# EAGLE design H851X (EAGLE 6.6.0)
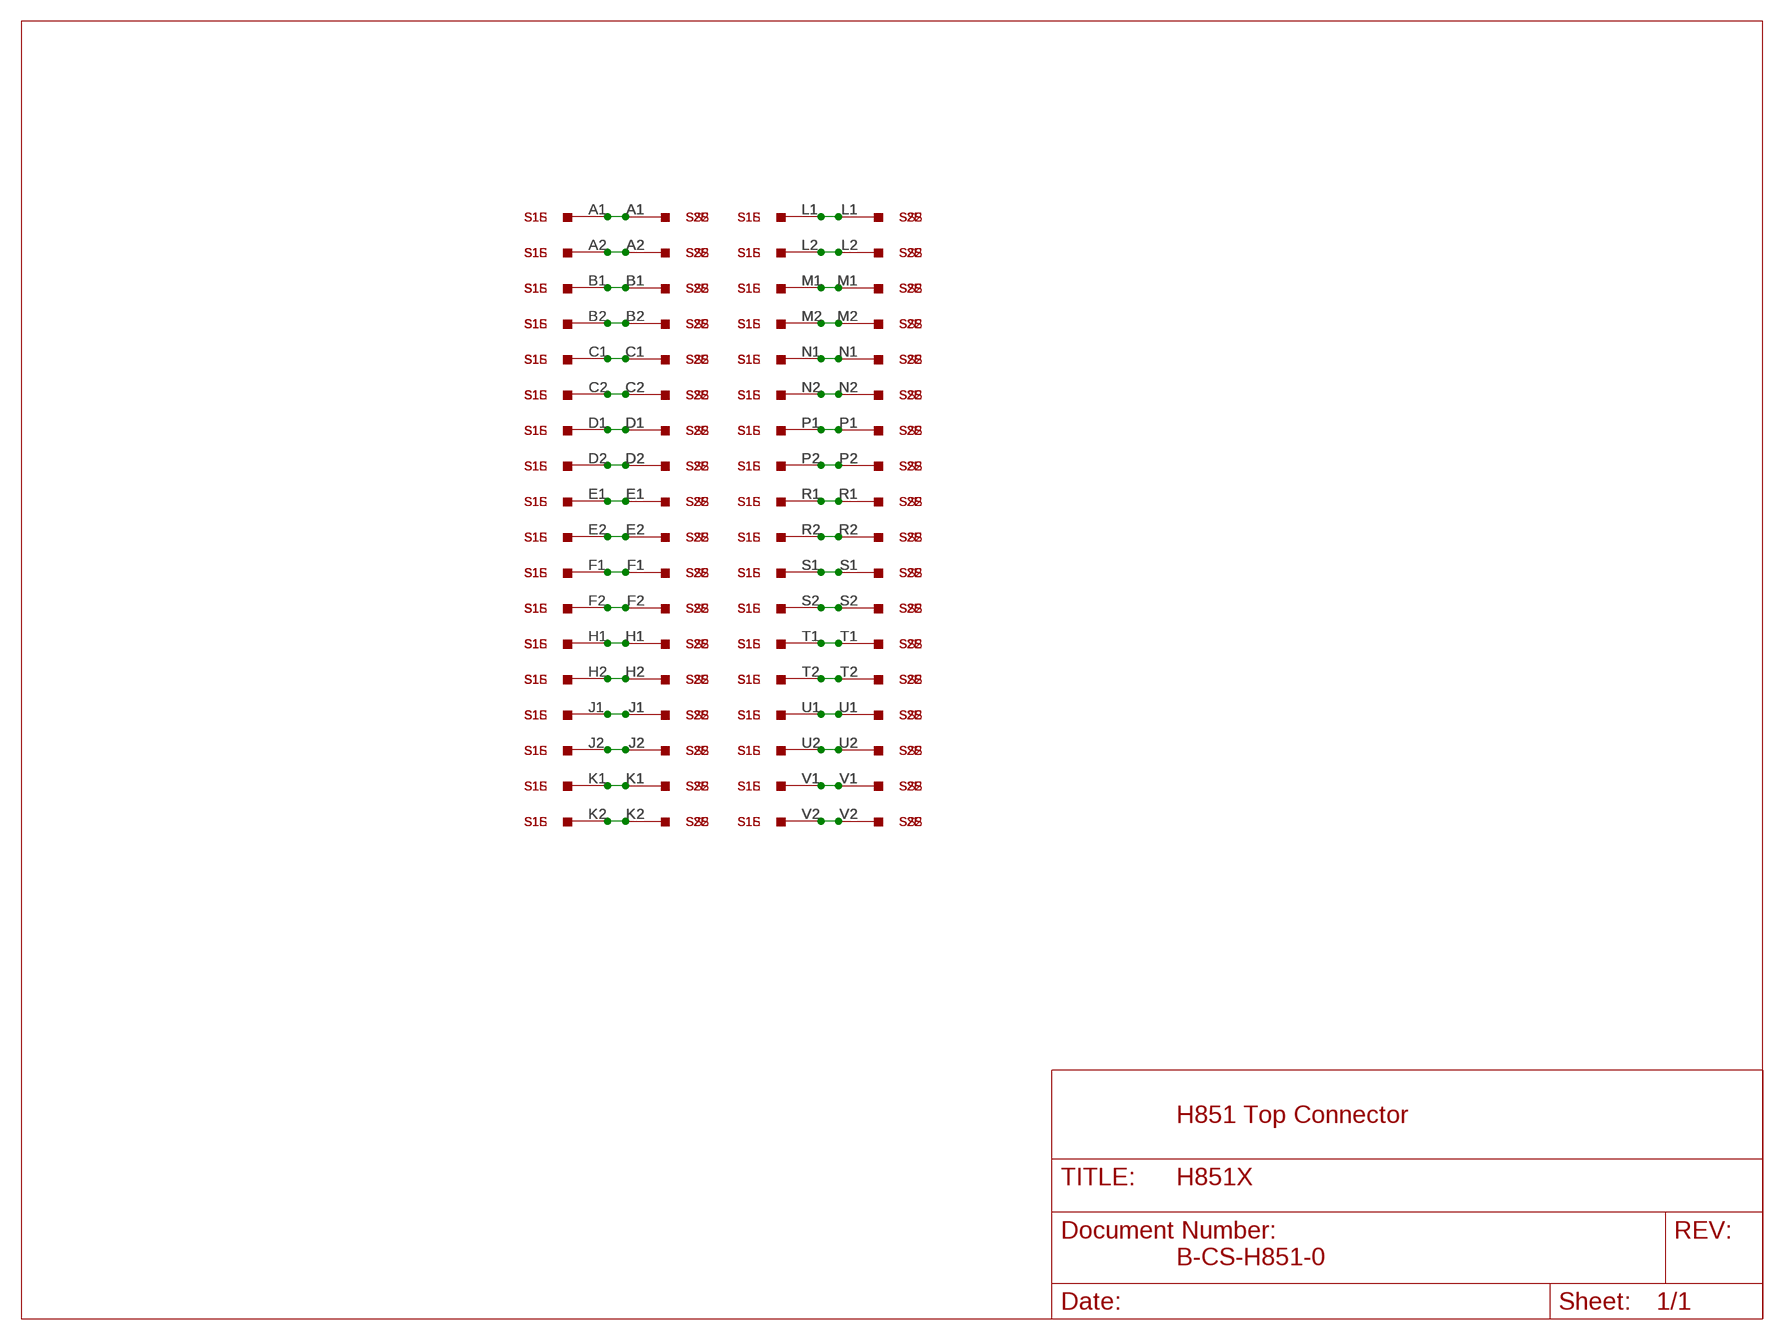
[diagram p0: schematic, sheet 1]

## Parts
S1  M916  [H807]
S1E  M916EDAC  [EDAC346-36]
S1S  M916ECS  [ECS2418]
S2  M916  [H807]
S2E  M916EDAC  [EDAC346-36]
S2S  M916ECS  [ECS2418]

## Nets
N$1: S1.L1 S1E.L1 S1S.L1 S2.L1 S2E.L1 S2S.L1
N$2: S1.L2 S1E.L2 S1S.L2 S2.L2 S2E.L2 S2S.L2
N$3: S1.M1 S1E.M1 S1S.M1 S2.M1 S2E.M1 S2S.M1
N$4: S1.M2 S1E.M2 S1S.M2 S2.M2 S2E.M2 S2S.M2
N$5: S1.N1 S1E.N1 S1S.N1 S2.N1 S2E.N1 S2S.N1
N$6: S1.N2 S1E.N2 S1S.N2 S2.N2 S2E.N2 S2S.N2
N$7: S1.P1 S1E.P1 S1S.P1 S2.P1 S2E.P1 S2S.P1
N$8: S1.P2 S1E.P2 S1S.P2 S2.P2 S2E.P2 S2S.P2
N$9: S1.R1 S1E.R1 S1S.R1 S2.R1 S2E.R1 S2S.R1
N$10: S1.R2 S1E.R2 S1S.R2 S2.R2 S2E.R2 S2S.R2
N$11: S1.S1 S1E.S1 S1S.S1 S2.S1 S2E.S1 S2S.S1
N$12: S1.S2 S1E.S2 S1S.S2 S2.S2 S2E.S2 S2S.S2
N$13: S1.T1 S1E.T1 S1S.T1 S2.T1 S2E.T1 S2S.T1
N$14: S1.T2 S1E.T2 S1S.T2 S2.T2 S2E.T2 S2S.T2
N$15: S1.U1 S1E.U1 S1S.U1 S2.U1 S2E.U1 S2S.U1
N$16: S1.U2 S1E.U2 S1S.U2 S2.U2 S2E.U2 S2S.U2
N$17: S1.V1 S1E.V1 S1S.V1 S2.V1 S2E.V1 S2S.V1
N$18: S1.V2 S1E.V2 S1S.V2 S2.V2 S2E.V2 S2S.V2
N$19: S1.A1 S1E.A1 S1S.A1 S2.A1 S2E.A1 S2S.A1
N$20: S1.A2 S1E.A2 S1S.A2 S2.A2 S2E.A2 S2S.A2
N$21: S1.B1 S1E.B1 S1S.B1 S2.B1 S2E.B1 S2S.B1
N$22: S1.B2 S1E.B2 S1S.B2 S2.B2 S2E.B2 S2S.B2
N$23: S1.C1 S1E.C1 S1S.C1 S2.C1 S2E.C1 S2S.C1
N$24: S1.C2 S1E.C2 S1S.C2 S2.C2 S2E.C2 S2S.C2
N$25: S1.D1 S1E.D1 S1S.D1 S2.D1 S2E.D1 S2S.D1
N$26: S1.D2 S1E.D2 S1S.D2 S2.D2 S2E.D2 S2S.D2
N$27: S1.E1 S1E.E1 S1S.E1 S2.E1 S2E.E1 S2S.E1
N$28: S1.E2 S1E.E2 S1S.E2 S2.E2 S2E.E2 S2S.E2
N$29: S1.F1 S1E.F1 S1S.F1 S2.F1 S2E.F1 S2S.F1
N$30: S1.F2 S1E.F2 S1S.F2 S2.F2 S2E.F2 S2S.F2
N$31: S1.H1 S1E.H1 S1S.H1 S2.H1 S2E.H1 S2S.H1
N$32: S1.H2 S1E.H2 S1S.H2 S2.H2 S2E.H2 S2S.H2
N$33: S1.J1 S1E.J1 S1S.J1 S2.J1 S2E.J1 S2S.J1
N$34: S1.J2 S1E.J2 S1S.J2 S2.J2 S2E.J2 S2S.J2
N$35: S1.K1 S1E.K1 S1S.K1 S2.K1 S2E.K1 S2S.K1
N$36: S1.K2 S1E.K2 S1S.K2 S2.K2 S2E.K2 S2S.K2

## Notes on the sheet
- H851 Top Connector
- B-CS-H851-0

## Library data of the parts
S1 S1E S1S S2 S2E S2S = dec-m:M916: Simple 36 pin connector/wire cable

## Board
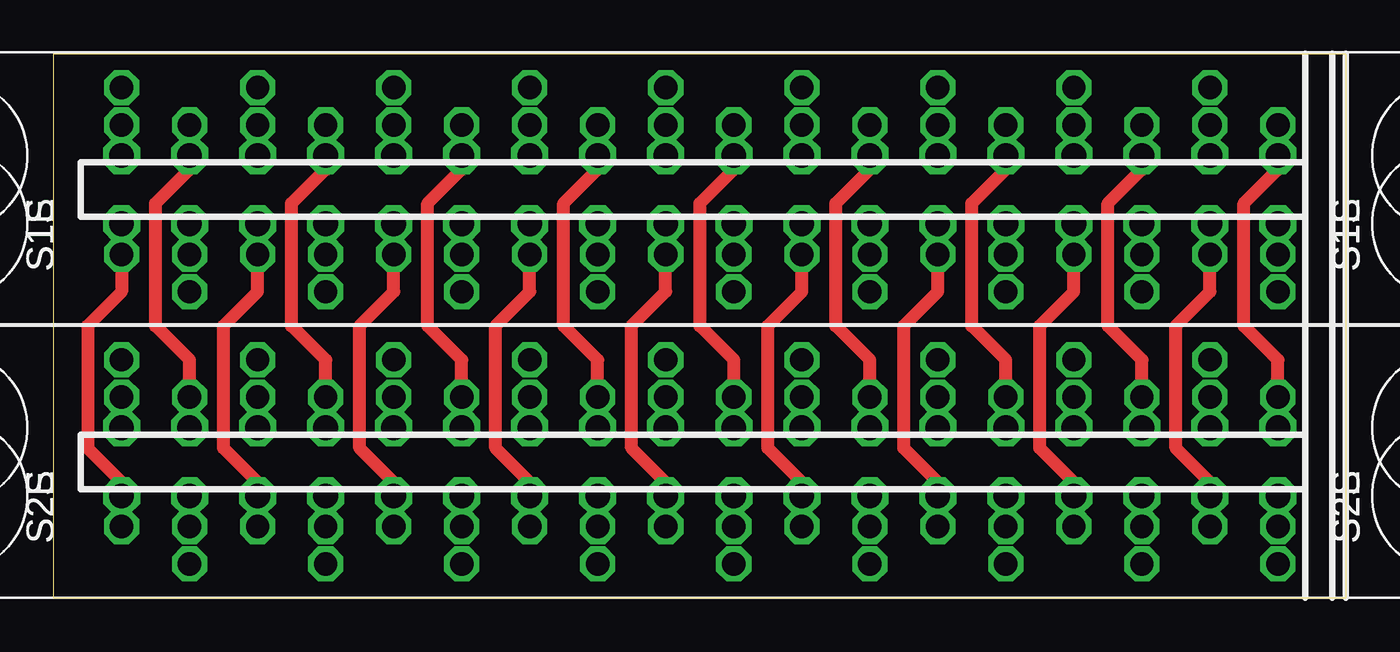
[diagram p1: board, top side]
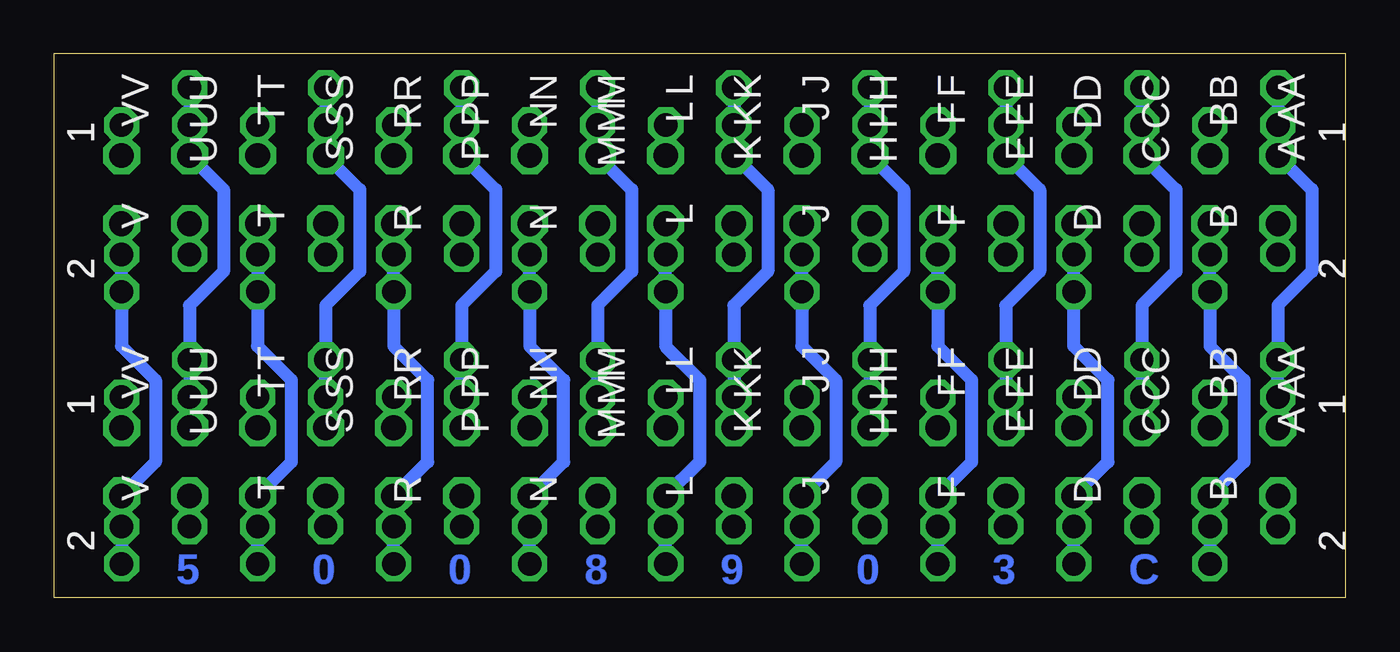
[diagram p2: board, bottom side, seen from below]

Size 60.33 x 25.4 mm. Coordinates in mm from the lower left corner, seen from the top.
Outline: 0,0 0,25.4 60.33,25.4 60.33,0 0,0
Copper layers (1+16): Top 0.035mm / dielectric 1.5mm / Bottom 0.035mm
Design rules "16mils": minimum track width 16mil, minimum drill 32mil, track to track 15mil, track to pad 10mil, pad to pad 10mil, via to via 10mil, smd to smd 10mil, copper to edge 13mil, drill to drill 10mil, minimum pad ring 10mil, minimum via ring 8mil, stop-mask expansion 0mil, vias tented up to drill 0mil, thermal gap 10mil

### Footprints (pad centres in the part's own frame; a part is rotated, then mirrored left to right if it is on the bottom)
H807 = drill 1.092 octagon: A1 4.763,28.575; A2 -1.587,28.575; B1 1.587,25.4; B2 -4.763,25.4; C1 4.763,22.225; C2 -1.587,22.225; D1 1.587,19.05; D2 -4.763,19.05; E1 4.763,15.875; E2 -1.587,15.875; F1 1.587,12.7; F2 -4.763,12.7; H1 4.763,9.525; H2 -1.587,9.525; J1 1.587,6.35; J2 -4.763,6.35; K1 4.763,3.175; K2 -1.587,3.175; L1 1.587,0; L2 -4.763,0; M1 4.763,-3.175; M2 -1.587,-3.175; N1 1.587,-6.35; N2 -4.763,-6.35; P1 4.763,-9.525; P2 -1.587,-9.525; R1 1.587,-12.7; R2 -4.763,-12.7; S1 4.763,-15.875; S2 -1.587,-15.875; T1 1.587,-19.05; T2 -4.763,-19.05; U1 4.763,-22.225; U2 -1.587,-22.225; V1 1.587,-25.4; V2 -4.763,-25.4
EDAC346-36 = drill 1.092 octagon: A1 3.016,28.575; A2 -3.016,28.575; B1 3.016,25.4; B2 -3.016,25.4; C1 3.016,22.225; C2 -3.016,22.225; D1 3.016,19.05; D2 -3.016,19.05; E1 3.016,15.875; E2 -3.016,15.875; F1 3.016,12.7; F2 -3.016,12.7; H1 3.016,9.525; H2 -3.016,9.525; J1 3.016,6.35; J2 -3.016,6.35; K1 3.016,3.175; K2 -3.016,3.175; L1 3.016,0; L2 -3.016,0; M1 3.016,-3.175; M2 -3.016,-3.175; N1 3.016,-6.35; N2 -3.016,-6.35; P1 3.016,-9.525; P2 -3.016,-9.525; R1 3.016,-12.7; R2 -3.016,-12.7; S1 3.016,-15.875; S2 -3.016,-15.875; T1 3.016,-19.05; T2 -3.016,-19.05; U1 3.016,-22.225; U2 -3.016,-22.225; V1 3.016,-25.4; V2 -3.016,-25.4
ECS2418 = drill 1.151 octagon: A1 1.587,28.575; A2 -1.587,28.575; B1 1.587,25.4; B2 -1.587,25.4; C1 1.587,22.225; C2 -1.587,22.225; D1 1.587,19.05; D2 -1.587,19.05; E1 1.587,15.875; E2 -1.587,15.875; F1 1.587,12.7; F2 -1.587,12.7; H1 1.587,9.525; H2 -1.587,9.525; J1 1.587,6.35; J2 -1.587,6.35; K1 1.587,3.175; K2 -1.587,3.175; L1 1.587,0; L2 -1.587,0; M1 1.587,-3.175; M2 -1.587,-3.175; N1 1.587,-6.35; N2 -1.587,-6.35; P1 1.587,-9.525; P2 -1.587,-9.525; R1 1.587,-12.7; R2 -1.587,-12.7; S1 1.587,-15.875; S2 -1.587,-15.875; T1 1.587,-19.05; T2 -1.587,-19.05; U1 1.587,-22.225; U2 -1.587,-22.225; V1 1.587,-25.4; V2 -1.587,-25.4

### Placement (x,y rotation side)
S1  31.75,19.05 90 top
S1E  31.75,19.05 90 top
S1S  31.75,19.05 90 top
S2  31.75,6.35 90 top
S2E  31.75,6.35 90 top
S2S  31.75,6.35 90 top

### Tracks (layer width: path | path; a pad name or v marks a point on that pad's centre or on a via)
N$1
  Top 0.61: S2S.L1 S2E.L1 31.75,11.11 30.16,12.7 30.16,18.41 31.75,20 S1S.L1 S1E.L1
N$2
  Bottom 0.61: S2.L2 S2E.L2 S2S.L2 30.16,6.35 30.16,10.16 31.75,11.75 S1.L2 S1E.L2 S1S.L2
N$3
  Bottom 0.61: S1.M1 S1E.M1 S1S.M1 33.34,19.05 33.34,15.24 34.92,13.65 S2.M1 S2E.M1 S2S.M1
N$4
  Top 0.61: S2E.M2 S2S.M2 34.92,5.4 33.34,6.99 33.34,12.7 34.92,14.29 S1E.M2 S1S.M2
N$5
  Top 0.61: S2S.N1 S2E.N1 38.1,11.11 36.51,12.7 36.51,18.41 38.1,20 S1S.N1 S1E.N1
N$6
  Bottom 0.61: S2.N2 S2E.N2 S2S.N2 36.51,6.35 36.51,10.16 38.1,11.75 S1.N2 S1E.N2 S1S.N2
N$7
  Bottom 0.61: S1.P1 S1E.P1 S1S.P1 39.69,19.05 39.69,15.24 41.27,13.65 S2.P1 S2E.P1 S2S.P1
N$8
  Top 0.61: S2E.P2 S2S.P2 41.27,5.4 39.69,6.99 39.69,12.7 41.27,14.29 S1E.P2 S1S.P2
N$9
  Top 0.61: S2S.R1 S2E.R1 44.45,11.11 42.86,12.7 42.86,18.41 44.45,20 S1S.R1 S1E.R1
N$10
  Bottom 0.61: S2.R2 S2E.R2 S2S.R2 42.86,6.35 42.86,10.16 44.45,11.75 S1.R2 S1E.R2 S1S.R2
N$11
  Bottom 0.61: S1.S1 S1E.S1 S1S.S1 46.04,19.05 46.04,15.24 47.62,13.65 S2.S1 S2E.S1 S2S.S1
N$12
  Top 0.61: S2E.S2 S2S.S2 47.62,5.4 46.04,6.99 46.04,12.7 47.62,14.29 S1E.S2 S1S.S2
N$13
  Top 0.61: S2S.T1 S2E.T1 50.8,11.11 49.21,12.7 49.21,18.41 50.8,20 S1S.T1 S1E.T1
N$14
  Bottom 0.61: S2.T2 S2E.T2 S2S.T2 49.21,6.35 49.21,10.16 50.8,11.75 S1.T2 S1E.T2 S1S.T2
N$15
  Bottom 0.61: S1.U1 S1E.U1 S1S.U1 52.39,19.05 52.39,15.24 53.98,13.65 S2.U1 S2E.U1 S2S.U1
N$16
  Top 0.61: S2E.U2 S2S.U2 53.98,5.4 52.39,6.99 52.39,12.7 53.98,14.29 S1E.U2 S1S.U2
N$17
  Top 0.61: S2S.V1 S2E.V1 57.15,11.11 55.56,12.7 55.56,18.41 57.15,20 S1S.V1 S1E.V1
N$18
  Bottom 0.61: S2.V2 S2E.V2 S2S.V2 55.56,6.35 55.56,10.16 57.15,11.75 S1.V2 S1E.V2 S1S.V2
N$19
  Bottom 0.61: S1.A1 S1E.A1 S1S.A1 1.59,19.05 1.59,15.24 3.17,13.65 S2.A1 S2E.A1 S2S.A1
N$20
  Top 0.61: S2E.A2 S2S.A2 3.17,5.4 1.59,6.99 1.59,12.7 3.17,14.29 S1E.A2 S1S.A2
N$21
  Top 0.61: S2S.B1 S2E.B1 6.35,11.11 4.76,12.7 4.76,18.41 6.35,20 S1S.B1 S1E.B1
N$22
  Bottom 0.61: S2.B2 S2E.B2 S2S.B2 4.76,6.35 4.76,10.16 6.35,11.75 S1.B2 S1E.B2 S1S.B2
N$23
  Bottom 0.61: S1.C1 S1E.C1 S1S.C1 7.94,19.05 7.94,15.24 9.53,13.65 S2.C1 S2E.C1 S2S.C1
N$24
  Top 0.61: S2E.C2 S2S.C2 9.53,5.4 7.94,6.99 7.94,12.7 9.53,14.29 S1E.C2 S1S.C2
N$25
  Top 0.61: S2S.D1 S2E.D1 12.7,11.11 11.11,12.7 11.11,18.41 12.7,20 S1S.D1 S1E.D1
N$26
  Bottom 0.61: S2.D2 S2E.D2 S2S.D2 11.11,6.35 11.11,10.16 12.7,11.75 S1.D2 S1E.D2 S1S.D2
N$27
  Bottom 0.61: S1.E1 S1E.E1 S1S.E1 14.29,19.05 14.29,15.24 15.88,13.65 S2.E1 S2E.E1 S2S.E1
N$28
  Top 0.61: S2E.E2 S2S.E2 15.88,5.4 14.29,6.99 14.29,12.7 15.88,14.29 S1E.E2 S1S.E2
N$29
  Top 0.61: S2S.F1 S2E.F1 19.05,11.11 17.46,12.7 17.46,18.41 19.05,20 S1S.F1 S1E.F1
N$30
  Bottom 0.61: S2.F2 S2E.F2 S2S.F2 17.46,6.35 17.46,10.16 19.05,11.75 S1.F2 S1E.F2 S1S.F2
N$31
  Bottom 0.61: S1.H1 S1E.H1 S1S.H1 20.64,19.05 20.64,15.24 22.23,13.65 S2.H1 S2E.H1 S2S.H1
N$32
  Top 0.61: S2E.H2 S2S.H2 22.23,5.4 20.64,6.99 20.64,12.7 22.23,14.29 S1E.H2 S1S.H2
N$33
  Top 0.61: S2S.J1 S2E.J1 25.4,11.11 23.81,12.7 23.81,18.41 25.4,20 S1S.J1 S1E.J1
N$34
  Bottom 0.61: S2.J2 S2E.J2 S2S.J2 23.81,6.35 23.81,10.16 25.4,11.75 S1.J2 S1E.J2 S1S.J2
N$35
  Bottom 0.61: S1.K1 S1E.K1 S1S.K1 26.99,19.05 26.99,15.24 28.57,13.65 S2.K1 S2E.K1 S2S.K1
N$36
  Top 0.61: S2E.K2 S2S.K2 28.57,5.4 26.99,6.99 26.99,12.7 28.57,14.29 S1E.K2 S1S.K2

### Text on the board
Bottom: C | 3 | 0 | 9 | 8 | 0 | 0 | 5